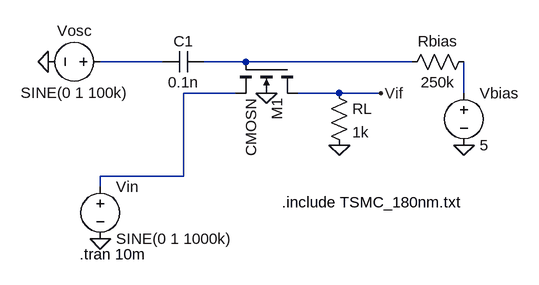
[diagram p0: schematic Mixer.asc]
Mixer.asc, the LTspice schematic file:
Version 4
SHEET 1 880 680
WIRE 16 160 -80 160
WIRE 144 160 80 160
WIRE 400 160 144 160
WIRE 128 208 48 208
WIRE 288 208 224 208
WIRE 352 208 288 208
WIRE 480 208 480 160
WIRE 48 336 48 208
WIRE 48 336 -80 336
WIRE -80 352 -80 336
FLAG 176 208 0
FLAG 288 288 0
FLAG 480 288 0
FLAG -80 432 0
FLAG -160 160 0
FLAG 352 208 Vif
SYMBOL nmos4 224 160 R90
SYMATTR InstName M1
SYMATTR Value CMOSN
SYMATTR Value2 l=0.18u w=1.8u ad=0.81p as=0.81p pd=4.5u ps=4.5u
SYMBOL cap 80 144 R90
WINDOW 0 0 32 VBottom 2
WINDOW 3 32 32 VTop 2
SYMATTR InstName C1
SYMATTR Value 0.1n
SYMBOL res 496 144 R90
WINDOW 0 0 56 VBottom 2
WINDOW 3 32 56 VTop 2
SYMATTR InstName Rbias
SYMATTR Value 250k
SYMBOL voltage 480 192 R0
SYMATTR InstName Vbias
SYMATTR Value 5
SYMBOL res 272 192 R0
SYMATTR InstName RL
SYMATTR Value 1k
SYMBOL voltage -80 336 R0
WINDOW 123 0 0 Left 0
WINDOW 39 0 0 Left 0
SYMATTR InstName Vin
SYMATTR Value SINE(0 1 1000k)
SYMBOL voltage -64 160 R90
WINDOW 0 -32 56 VBottom 2
WINDOW 3 32 56 VTop 2
WINDOW 123 0 0 Left 0
WINDOW 39 0 0 Left 0
SYMATTR InstName Vosc
SYMATTR Value SINE(0 1 100k)
TEXT -112 456 Left 2 !.tran 10m
TEXT 200 376 Left 2 !.include TSMC_180nm.txt

The netlist it stands for:
* Mixer.asc
M1 Vif N002 N003 0 CMOSN l=0.18u w=1.8u ad=0.81p as=0.81p pd=4.5u ps=4.5u
C1 N002 N001 0.1n
Rbias N004 N002 250k
Vbias N004 0 5
RL Vif 0 1k
Vin N003 0 SINE(0 1 1000k)
Vosc N001 0 SINE(0 1 100k)
.model NMOS NMOS
.model PMOS PMOS
.lib standard.mos
.tran 10m
.include TSMC_180nm.txt
.backanno
.end